# EAGLE design Arduino_PID_for_Espresso_v2_Rev_C (EAGLE 6.4)
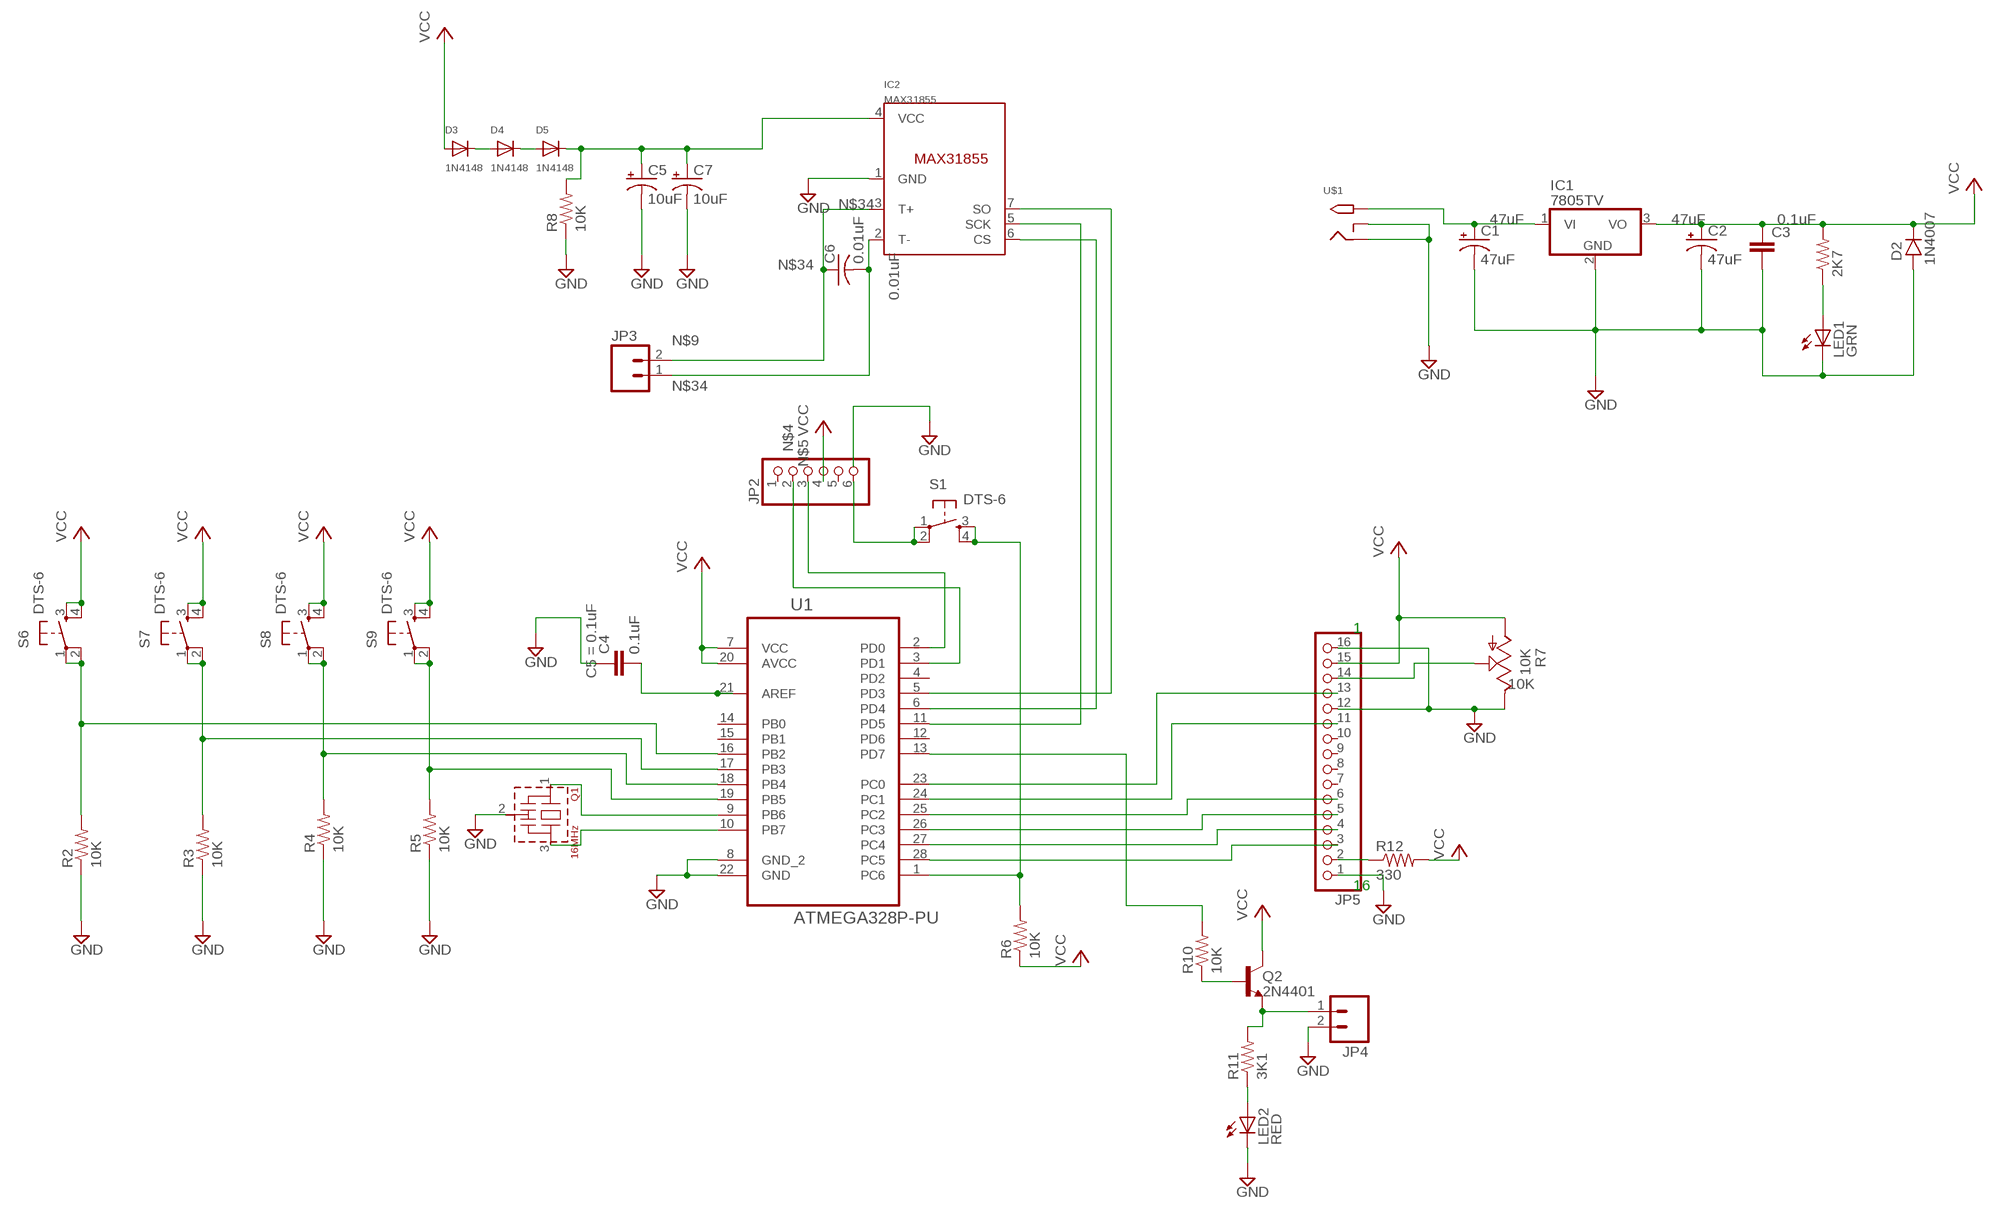
[diagram p0: schematic, sheet 1]

## Parts
C1  47uF  CPOL-USTT6D6  [TT5D6]
C2  47uF  CPOL-USTT6D6  [TT5D6]
C3  C-EU025-024X044  [C025-024X044]
C4  0.1uF  C-EU025-024X044  [C025-024X044]
C5  10uF  CAP_POLPTH2  [CPOL-RADIAL-10UF-25V]
C6  0.01uF  C-US025-024X044  [C025-024X044]
C7  10uF  CAP_POLPTH2  [CPOL-RADIAL-10UF-25V]
D2  1N4007  1N400X.3  [DO41-3]
D3  1N4148  DIODEDO-1N4148  [DO-1N4148]
D4  1N4148  DIODEDO-1N4148  [DO-1N4148]
D5  1N4148  DIODEDO-1N4148  [DO-1N4148]
IC1  7805TV  [TO220V]
IC2  MAX31855  [SOIC8]
JP2  PINHD-1X6/90  [1X06/90]
JP3  M023.5MM  [SCREWTERMINAL-3.5MM-2]
JP4  M023.5MM  [SCREWTERMINAL-3.5MM-2]
JP5  PINHD-1X16  [1X16]
LED1  GRN  LED3MM  [LED3MM]
LED2  RED  LED3MM  [LED3MM]
Q1  16MHz  CSTLA_X  [CSTLA_T]
Q2  2N4401  2N3904  [TO92-]
R1  2K7  RESISTORPTH-1/4W  [AXIAL-0.4]
R2  10K  RESISTORPTH-1/6W  [1/6W-RES]
R3  10K  RESISTORPTH-1/6W  [1/6W-RES]
R4  10K  RESISTORPTH-1/6W  [1/6W-RES]
R5  10K  RESISTORPTH-1/6W  [1/6W-RES]
R6  10K  RESISTORPTH-1/6W  [1/6W-RES]
R7  10K  TRIM_US-B25P  [B25P]
R8  10K  RESISTORPTH-1/6W  [1/6W-RES]
R10  10K  RESISTORPTH-1/6W  [1/6W-RES]
R11  3K1  RESISTORPTH-1/4W  [AXIAL-0.4]
R12  330  RESISTORPTH-1/4W  [AXIAL-0.4]
S1  DTS-6  [DTS-6]
S6  DTS-6  [DTS-6]
S7  DTS-6  [DTS-6]
S8  DTS-6  [DTS-6]
S9  DTS-6  [DTS-6]
U1  ATMEGA328P-PU  [DIP254P762X457-28]
U$1  2.1MMJACKTHM  [PJ-102A]

## Nets
GND: C1.- C2.- C3.2 C4.1 C5.2(-) C7.2(-) D2.A IC1.2(GND) IC2.1(GND) JP2.6 JP4.2 JP5.1 JP5.12 JP5.16 LED1.K(C) LED2.K(C) Q1.2(VSS) R2.1 R3.1 R4.1 R5.1 R7.E R8.1 S1.1 S1.2 U1.8(GND_2) U1.22(GND) U$1.RING U$1.RING_SW
N$1: C1.+ IC1.1(VI) U$1.TIP
N$2: C4.2 U1.21(AREF)
N$3: LED1.A R1.P$1
N$4: JP2.2 U1.3(PD1)
N$5: JP2.3 U1.2(PD0)
N$6: R2.2 S6.1 S6.2 U1.16(PB2)
N$7: JP5.14 R7.S
N$8: JP5.2 R12.P$1
N$9: C6.2 IC2.2(T-) JP3.1
N$10: R4.2 S8.1 S8.2 U1.18(PB4)
N$11: Q1.1 U1.9(PB6)
N$12: Q1.3 U1.10(PB7)
N$14: R6.2 S1.3 S1.4 U1.1(PC6)
N$15: R3.2 S7.1 S7.2 U1.17(PB3)
N$16: R5.2 S9.1 S9.2 U1.19(PB5)
N$18: JP5.3 U1.28(PC5)
N$19: JP5.4 U1.27(PC4)
N$20: IC2.6(CS) U1.6(PD4)
N$21: JP5.5 U1.26(PC3)
N$22: IC2.7(SO) U1.5(PD3)
N$23: IC2.5(SCK) U1.11(PD5)
N$24: D3.C D4.A
N$25: D4.C D5.A
N$26: C5.1(+) C7.1(+) D5.C IC2.4(VCC) R8.2
N$27: JP5.6 U1.25(PC2)
N$28: JP5.11 U1.24(PC1)
N$29: JP5.13 U1.23(PC0)
N$30: Q2.2(B) R10.1
N$31: JP4.1 Q2.3(E) R11.P$2
N$32: R10.2 U1.13(PD7)
N$33: LED2.A R11.P$1
N$34: C6.1 IC2.3(T+) JP3.2
VCC: C2.+ C3.1 D2.C D3.A IC1.3(VO) JP2.4 JP5.15 Q2.1(C) R1.P$2 R6.1 R7.A R12.P$2 S6.3 S6.4 S7.3 S7.4 S8.3 S8.4 S9.3 S9.4 U1.7(VCC) U1.20(AVCC)
Unconnected: JP2.1 JP2.5 JP5.7 JP5.8 JP5.9 JP5.10 U1.4(PD2) U1.12(PD6) U1.14(PB0) U1.15(PB1)

## Notes on the sheet
- 1
- 16

## Library data of the parts
C1 = rcl:CPOL-US: POLARIZED CAPACITOR, American symbol; C1: 47uF
C2 = rcl:CPOL-US: POLARIZED CAPACITOR, American symbol; C2: 47uF
C3 = rcl:C-EU: CAPACITOR, European symbol; C3: 0.1uF
C4 = rcl:C-EU: CAPACITOR, European symbol; C5: 0.1uF
C5 C7 = SparkFun-Passives:CAP_POL: Capacitor Polarized These are standard SMD and PTH capacitors. Normally 10uF, 47uF, and 100uF in electrolytic and tantalum varieties. Always verify the external diameter of the through hole cap, it varies with capacity, voltage, and manufacturer. The EIA devices should be standard.
C6 = adafruit:C-US: CAPACITOR, American symbol; C6: 0.01uF
D2 = gm-diodes:1N400X: Rectifier Diodes often used in power supply to prevent damage from reverse polarization
D3-D5 = adafruit:DIODE: Diode SMADIODE - SMA Surface Mount Package 20V 1A Schottky Diode Digikey: 641-1014-6-ND DO-1N4148 - Through Hole Small Current Diode SOD-123 20V 1 A (.5mV Vf) Schottky Diode - Digikey: MBRX120TPMSCT-ND SOD-323 10V 570mA (.38mV Vf, 3ns) Schottky Diode - Digikey: ZLLS410CT-ND SOD-523 30V 30mA Schottky Diode (RB751S-40TE61) - Digikey: RB751S-40TE61CT-ND SOT23-R/W - SOT23 Package (R = Solder Paste/Reflow Ovens, W = Hand-Soldering) BAT54Film 40V 300mA - Digikey: 497-7162-1-ND
IC1 = linear:78*: Positive VOLTAGE REGULATOR Source: http://cache.national.com/ds/LM/LM78L05.pdf http://www.fairchildsemi.com/ds/LM/LM7805.pdf
IC2 = AlexW-Eagle-Libraries:MAX31855
JP2 = 1x6pinhead:PINHD-1X6: PIN HEADER
JP3 JP4 = SparkFun-Connectors:M02: Header 2 Standard 2-pin 0.1" header. Use with straight break away headers (SKU : PRT-00116), right angle break away headers (PRT-00553), swiss pins (PRT-00743), machine pins (PRT-00117), and female headers (PRT-00115). Molex polarized connector foot print use with SKU : PRT-08233 with associated crimp pins and housings.
JP5 = pinhead:PINHD-1X16: PIN HEADER
LED1 LED2 = adafruit:LED: LED OSRAM: - CHIPLED LG R971, LG N971, LY N971, LG Q971, LY Q971, LO R971, LY R971 LH N974, LH R974 LS Q976, LO Q976, LY Q976 LO Q996 - Hyper CHIPLED LW Q18S LB Q993, LB Q99A, LB R99A - SideLED LS A670, LO A670, LY A670, LG A670, LP A670 LB A673, LV A673, LT A673, LW A673 LH A674 LY A675 LS A676, LA A676, LO A676, LY A676, LW A676 LS A679, LY A679, LG A679 - Hyper Micro SIDELED® LS Y876, LA Y876, LO Y876, LY Y876 LT Y87S - SmartLED LW L88C, LW L88S LB L89C, LB L89S, LG L890 LS L89K, LO L89K, LY L89K LS L896, LA L896, LO L896, LY L896 - TOPLED LS T670, LO T670, LY T670, LG T670, LP T670 LSG T670, LSP T670, LSY T670, LOP T670, LYG T670 LG T671, LOG T671, LSG T671 LB T673, LV T673, LT T673, LW T673 LH T674 LS T676, LA T676, LO T676, LY T676, LB T676, LH T676, LSB T676, LW T676 LB T67C, LV T67C, LT T67C, LS T67K, LO T67K, LY T67K, LW E67C LS E67B, LA E67B, LO E67B, LY E67B, LB E67C, LV E67C, LT E67C LW T67C LS T679, LY T679, LG T679 LS T770, LO T770, LY T770, LG T770, LP T770 LB T773, LV T773, LT T773, LW T773 LH T774 LS E675, LA E675, LY E675, LS T675 LS T776, LA T776, LO T776, LY T776, LB T776 LHGB T686 LT T68C, LB T68C - Hyper Mini TOPLED® LB M676 - Mini TOPLED Santana® LG M470 LS M47K, LO M47K, LY M47K Source: http://www.osram.convergy.de/
Q1 = murata-resonators:CSTLA_X: Ceramic resonator 13.01 to 15.99 MHz
Q2 = gm-trans:2N3904: NPN Transistor
R1-R6 R8 R10 R12 = SparkFun-Passives:RESISTOR: Resistor Basic schematic elements and footprints for 0603, 1206, and PTH resistors.
R7 = pot:TRIM_US-: POTENTIOMETER; VR1: 10K
R11 = SparkFun-Resistors:RESISTOR: Resistor Basic schematic elements and footprints for 0603, 1206, and PTH resistors.
S1 S6-S9 = switch-tact:DTS-6
U1 = Atmel_By_element14_Batch_1:ATMEGA328P-PU: 8-bit Microcontroller with In-System Programmable Flash; MPN: ATMEGA328P-PU; OC_FARNELL: 1715487; OC_NEWARK: 15R0268; PACKAGE: PDIP-28; SUPPLIER: Atmel
U$1 = adafruit:2.1MMJACK: 2.1mm x 5.5mm THM DC jack with internal switch. Digikey part #PJ-102A, 4UCON part #05537 2.1mm x 5.5mm SMT DC jack with internal switch. Digikey part #PJ-002A-SMT, 4UCON part #03267 By microbuilder.eu & adafruit.com

## Board
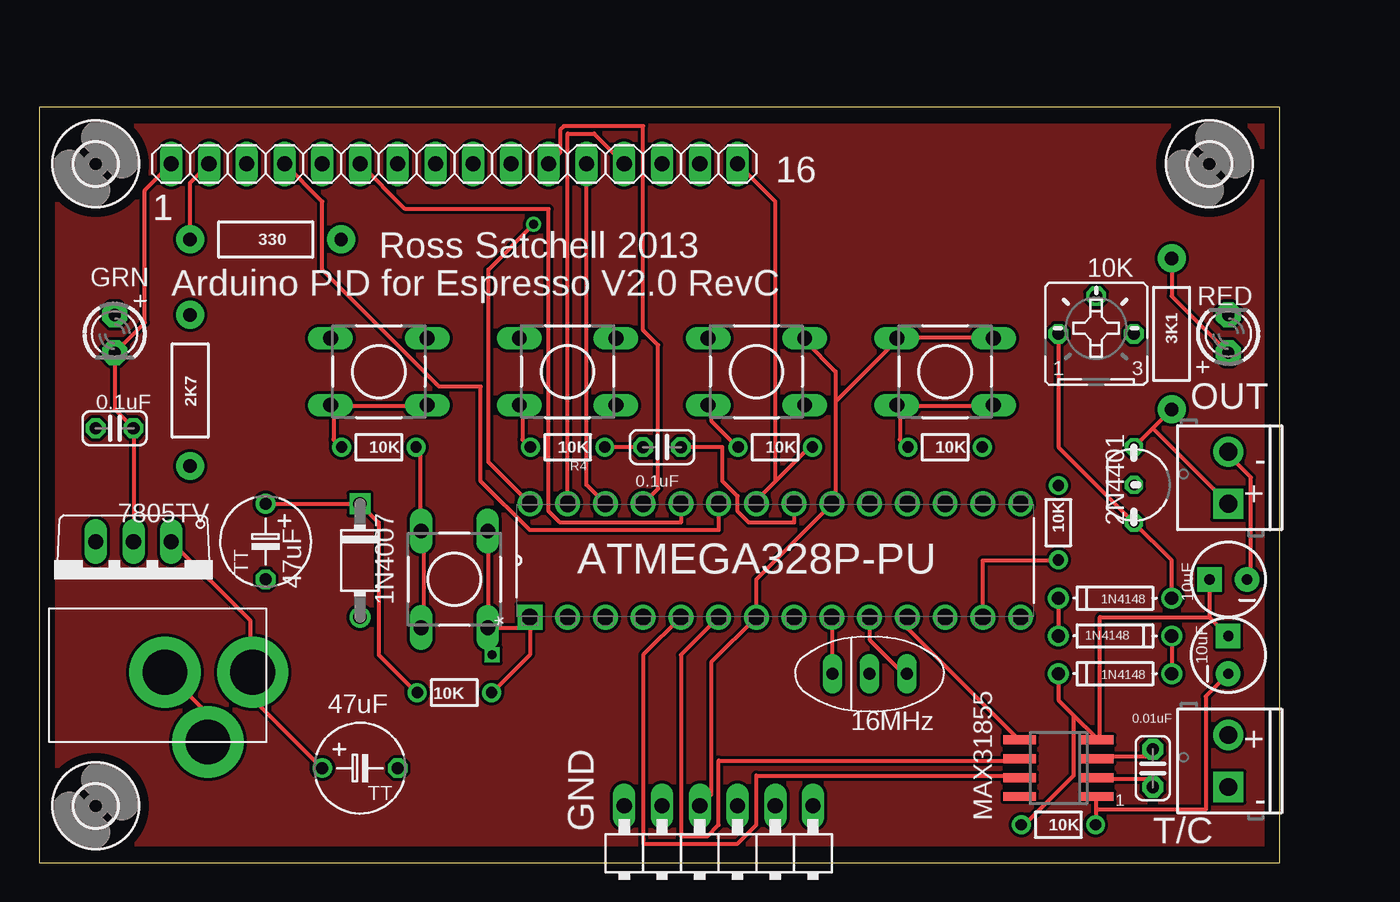
[diagram p1: board, top side]
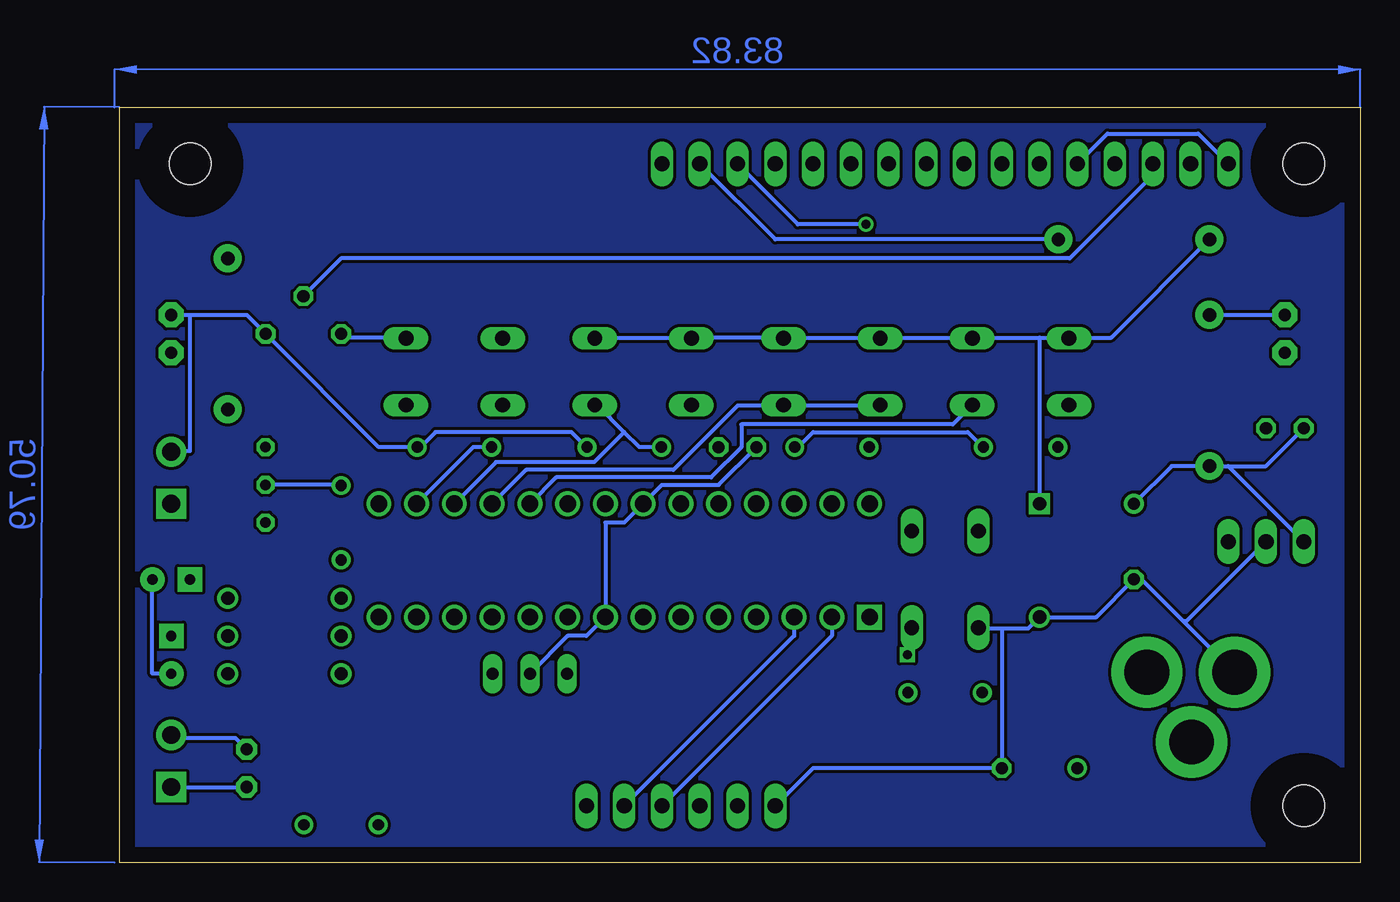
[diagram p2: board, bottom side, seen from below]

Size 83.49 x 50.79 mm. Coordinates in mm from the lower left corner, seen from the top.
Outline: 0,0 83.49,0 83.49,50.79 0,50.79 0,0
Copper layers (1*16): Top 0.035mm / dielectric 1.5mm / Bottom 0.035mm
Design rules "default": minimum track width 10mil, minimum drill 24mil, track to track 8mil, track to pad 8mil, pad to pad 8mil, via to via 8mil, smd to smd 8mil, copper to edge 40mil, drill to drill 8mil, minimum pad ring 10mil, minimum via ring 8mil, stop-mask expansion 4mil, vias tented up to drill 0mil, thermal gap 10mil

### Footprints (pad centres in the part's own frame; a part is rotated, then mirrored left to right if it is on the bottom)
TT5D6 = drill 0.813: + -2.54,0 | drill 0.813 octagon: - 2.54,0
C025-024X044 = drill 0.813 octagon: 1 -1.27,0; 2 1.27,0
CPOL-RADIAL-10UF-25V = drill 0.7 pad 1.651 square: 1 1.27,0 | drill 0.7 pad 1.651: 2 -1.27,0
C025-024X044' = drill 0.813 pad 1.422 octagon: 1 -1.27,0; 2 1.27,0
DO41-3 = drill 0.9: A 3.81,0 | drill 0.9 square: C -3.81,0
DO-1N4148 = drill 0.9: A -3.81,0; C 3.81,0
TO220V = drill 1.016 long: 1 -2.54,-2.54; 2 0,-2.54; 3 2.54,-2.54
SOIC8 = smd 0.6 x 2.2: 1 -1.905,-2.6; 2 -0.635,-2.6; 3 0.635,-2.6; 4 1.905,-2.6; 5 1.905,2.6; 6 0.635,2.6; 7 -0.635,2.6; 8 -1.905,2.6
1X06/90 = drill 1.016 long: 1 -6.35,-3.81; 2 -3.81,-3.81; 3 -1.27,-3.81; 4 1.27,-3.81; 5 3.81,-3.81; 6 6.35,-3.81
SCREWTERMINAL-3.5MM-2 = drill 1.2 pad 2.032 square: 1 0,0 | drill 1.2 pad 2.032: 2 3.5,0
1X16 = drill 1.016 long: 1 -19.05,0; 2 -16.51,0; 3 -13.97,0; 4 -11.43,0; 5 -8.89,0; 6 -6.35,0; 7 -3.81,0; 8 -1.27,0; 9 1.27,0; 10 3.81,0; 11 6.35,0; 12 8.89,0; 13 11.43,0; 14 13.97,0; 15 16.51,0; 16 19.05,0
LED3MM = drill 0.813 pad 1.676 octagon: A -1.27,0; K 1.27,0
CSTLA_T = drill 0.813 long: 1 -2.5,0; 2 0,0; 3 2.5,0
TO92- = drill 0.7 octagon: 1 2.54,0; 2 0,0; 3 -2.54,0
AXIAL-0.4 = drill 0.9 pad 1.88: P$1 -5.08,0; P$2 5.08,0
1/6W-RES = drill 0.762: 1 -2.5,0; 2 2.5,0
B25P = drill 0.813 octagon: A -2.54,0; E 2.54,0; S 0,2.54
DTS-6 = drill 1 long: 1 -3.25,2.25; 2 3.25,2.25; 3 -3.25,-2.25; 4 3.25,-2.25
DIP254P762X457-28 = drill 1.118 square: 1 -7.62,33.02 | drill 1.118: 2 -7.62,30.48; 3 -7.62,27.94; 4 -7.62,25.4; 5 -7.62,22.86; 6 -7.62,20.32; 7 -7.62,17.78; 8 -7.62,15.24; 9 -7.62,12.7; 10 -7.62,10.16; 11 -7.62,7.62; 12 -7.62,5.08; 13 -7.62,2.54; 14 -7.62,0; 15 0,0; 16 0,2.54; 17 0,5.08; 18 0,7.62; 19 0,10.16; 20 0,12.7; 21 0,15.24; 22 0,17.78; 23 0,20.32; 24 0,22.86; 25 0,25.4; 26 0,27.94; 27 0,30.48; 28 0,33.02
PJ-102A = drill 3 pad 4.8: RING 0.1,-3.39; RING_SW -4.6,-6.29; TIP 0.1,-9.29
2,8 = hole 2.8: 0,0

### Placement (x,y rotation side)
C1  21.59,6.35 0 top
C2  15.24,21.59 270 top
C3  5.08,29.21 0 top
C4  41.91,27.94 0 top
C5  80.01,19.05 180 top
C6  0.01uF  [C025-024X044']  74.93,6.35 270 top
C7  80.01,13.97 90 top
D2  21.59,20.32 270 top
D3  72.39,17.78 180 top
D4  72.39,15.24 0 top
D5  72.39,12.7 180 top
IC1  6.35,19.05 180 top
IC2  68.58,6.35 90 top
JP2  45.72,0 180 top
JP3  80.01,5.08 90 top
JP4  80.01,24.13 90 top
JP5  27.94,46.99 180 top
LED1  5.08,35.56 270 top
LED2  80.01,35.56 90 top
Q1  55.88,12.7 0 top
Q2  73.66,25.4 270 top
R1  10.16,31.75 270 top
R2  60.96,27.94 180 top
R3  49.53,27.94 180 top
R4  35.56,27.94 180 top
R5  22.86,27.94 180 top
R6  27.94,11.43 0 top
R7  71.12,35.56 0 top
R8  68.58,2.54 180 top
R10  68.58,22.86 270 top
R11  76.2,35.56 270 top
R12  15.24,41.91 180 top
S1  27.94,19.05 90 top
S6  60.96,33.02 180 top
S7  48.26,33.02 180 top
S8  35.56,33.02 180 top
S9  22.86,33.02 180 top
U1  66.04,24.13 90 top
U$1  5.08,12.7 90 top
U$2  [2,8]  78.74,46.99 0 top
U$3  [2,8]  3.81,3.81 0 top
U$4  [2,8]  3.81,46.99 0 top

### Tracks (layer width: path | path; a pad name or v marks a point on that pad's centre or on a via)
GND
  Top 0.254: IC1.2 C3.2 5.08,30.48 LED1.K 7.11,36.32 7.11,45.21 JP5.16 | U$1.RING 8.64,12.7 11.18,10.16 11.18,8.13 U$1.RING_SW | R5.1 25.4,27.94 25.65,27.69 25.65,22.35 S1.2 25.91,22.1 25.91,16 S1.1 | 71.12,3.56 71.12,2.54 R8.1 | 71.12,3.56 71.12,4.32 IC2.1 | 71.12,3.56 78.49,3.56 78.49,11.18 C7.2 | C5.2 81.53,19.3 81.53,25.91 80.01,27.43 JP4.2 | C4.1 R4.1 | 49.53,25.65 48.26,24.38 U1.22 | 49.53,25.65 51.82,27.94 R3.1 | JP5.1 49.53,44.45 49.53,25.65
  Bottom 0.254: JP5.16 10.92,49.02 17.02,49.02 JP5.12 | 24.13,15.75 C1.- 36.83,6.35 JP2.6 | 24.13,15.75 25.65,15.75 S1.1 | 24.13,15.75 22.35,15.75 D2.A 17.78,16.51 C2.- 14.73,19.05 11.94,16.26 | 11.94,16.26 8.64,12.95 U$1.RING | IC1.2 11.68,16.26 11.94,16.26 | LED2.K 78.74,36.83 | 78.74,36.83 74.93,36.83 R7.E 66.04,27.94 R2.1 63.25,27.94 62.23,28.96 53.09,28.96 52.07,27.94 R3.1 | C5.2 81.28,12.7 C7.2 | 78.74,36.83 78.74,27.69 80.01,27.69 JP4.2 | Q1.2 53.34,15.24 52.07,15.24 U1.8 50.8,22.86 49.53,22.86 U1.22 46.99,25.4 43.18,25.4 C4.1 | R5.1 25.4,27.94 26.42,28.96 36.83,28.96 37.85,27.94 R4.1
N$1
  Top 0.254: C1.+ 14.48,10.92 14.48,12.7 U$1.TIP 14.22,12.95 14.22,16.26 IC1.1
N$2
  Top 0.254: C4.2 45.97,27.94 45.97,25.65 46.99,24.64 46.99,23.62 47.75,22.86 50.8,22.86 U1.21
N$3
  Bottom 0.254: R1.P$1 LED1.A
N$4
  Bottom 0.254: JP2.2 38.1,15.24 U1.3
N$5
  Bottom 0.254: JP2.3 35.56,15.24 U1.2
N$6
  Top 0.254: 57.91,30.73 57.91,28.45 58.42,27.94 R2.2 | 57.91,30.73 64.01,30.73 S6.1 | 57.91,30.73 S6.2
  Bottom 0.254: U1.16 59.69,27.94 R2.2
N$7
  Bottom 0.254: R7.S 68.58,40.64 19.56,40.64 13.97,46.23 JP5.14
N$8
  Bottom 0.254: JP5.2 39.37,41.91 R12.P$1
N$9
  Top 0.254: C6.2 74.93,5.59 71.37,5.59 IC2.2
  Bottom 0.254: JP3.1 C6.2
N$10
  Top 0.254: R4.2 33.02,27.94 32.51,28.45 32.51,30.73 S8.2
  Bottom 0.254: S8.2 32.51,30.73 38.61,30.73 S8.1 38.86,30.73 41.91,30.73 46.23,26.42 56.13,26.42 U1.18
N$11
  Top 0.254: U1.9 53.34,12.7 Q1.1
N$12
  Top 0.254: U1.10 55.88,14.99 58.17,12.7 Q1.3
N$13  (via drill 0.6)
  other vias: 30.48,13.97
N$14
  Top 0.254: 33.02,15.75 33.02,13.97 30.48,11.43 R6.2 | 33.02,15.75 30.23,15.75 S1.3 30.23,16 30.23,22.1 S1.4 | 33.02,15.75 U1.1
N$15
  Top 0.254: R3.2 46.99,27.94 45.21,29.72 45.21,30.73 S7.2
  Bottom 0.254: 49.53,28.96 48.51,27.94 R3.2 | 49.53,28.96 51.31,30.73 S7.1 | U1.17 58.17,26.92 51.56,26.92 49.53,28.96
N$16
  Top 0.254: 19.81,30.73 19.81,28.45 20.32,27.94 R5.2 | 19.81,30.73 25.91,30.73 S9.1 | 19.81,30.73 S9.2
  Bottom 0.254: U1.19 54.1,25.91 43.69,25.91 41.66,27.94 41.66,29.46 27.43,29.46 26.16,30.73 S9.1
N$17
  pour Top: 1.27,49.53 82.55,49.53 82.55,1.27 1.27,1.27
N$18  (via drill 0.61)
  Top 0.254: v33.27,42.93 30.23,39.88 30.23,26.92 U1.28
  Bottom 0.254: JP5.3 37.85,42.93 v33.27,42.93
N$19
  Top 0.254: JP5.4 37.34,49.02 35.56,49.02 U1.27
N$20
  Top 0.254: U1.6 43.18,13.97 43.18,1.78 44.96,1.78 45.72,2.54 45.72,6.86 65.79,6.86 IC2.6
N$21
  Top 0.254: JP5.5 36.83,25.4 U1.26
N$22
  Top 0.254: U1.5 40.64,13.97 40.64,1.27 46.99,1.27 48.26,2.54 48.26,5.84 65.79,5.84 IC2.7
N$23
  Top 0.254: U1.11 58.42,15.75 65.79,8.38 IC2.5
N$24
  Top 0.254: D3.C D4.A
N$25
  Top 0.254: D4.C D5.A
N$26
  Top 0.254: 78.74,16.51 C7.1 | C5.1 78.74,16.51 | 69.6,9.91 68.58,10.92 D5.C | 69.6,9.91 71.12,8.38 IC2.4 71.37,8.38 71.37,16.51 78.74,16.51 | 69.6,9.91 69.6,5.84 66.29,2.54 R8.2
N$27
  Top 0.254: JP5.6 35.05,47.75 35.05,49.28 35.31,49.53 40.64,49.53 40.64,35.81 41.66,34.8 41.66,25.15 U1.25
N$28
  Top 0.254: JP5.11 24.64,43.94 34.29,43.94 34.29,23.62 35.05,22.86 43.18,22.86 U1.24
N$29
  Top 0.254: JP5.13 19.05,44.45 19.05,39.88 26.92,32 29.72,32 29.72,25.65 33.02,22.35 45.72,22.35 U1.23
N$30
  Bottom 0.254: Q2.2 68.58,25.4 R10.1
N$31
  Top 0.254: R11.P$2 74.93,29.21 | 74.93,29.21 Q2.3 | 74.93,29.21 JP4.1
N$32
  Top 0.254: U1.13 63.5,20.32 68.58,20.32 R10.2
N$33
  Top 0.254: LED2.A 76.2,38.1 R11.P$1
N$34
  Top 0.254: C6.1 74.93,7.11 71.37,7.11 IC2.3
  Bottom 0.254: C6.1 75.69,8.38 80.01,8.38 JP3.2
N$35
  pour Bottom: 1.27,49.53 82.55,49.53 82.55,1.27 1.27,1.27
VCC
  Top 0.254: R6.1 25.4,11.43 22.86,13.97 22.86,22.86 D2.C C2.+ | D3.A 76.2,20.32 Q2.1 68.58,27.94 R7.A | S6.3 64.01,35.31 57.91,35.31 S6.4 57.66,35.05 53.59,30.99 | JP2.4 45.21,4.57 45.21,13.46 U1.7 48.26,19.05 U1.20 53.59,24.38 53.59,30.99 | JP5.15 10.16,45.72 R12.P$2 | 53.59,30.99 53.59,33.02 51.56,35.05 S7.3
  Bottom 0.254: C2.+ 12.7,26.67 R1.P$2 8.89,26.67 | C3.1 6.35,26.67 8.89,26.67 | 8.89,26.67 IC1.3 | R7.A 68.33,35.31 64.26,35.31 S6.3 | S7.3 51.31,35.31 45.21,35.31 S7.4 44.96,35.31 38.86,35.31 S8.3 38.61,35.31 32.51,35.31 S8.4 32.26,35.31 26.16,35.31 S9.3 25.91,35.31 21.59,35.31 | 21.59,35.31 19.81,35.31 S9.4 19.56,35.31 16.76,35.31 R12.P$2 | 21.59,35.31 D2.C
(copper drawn outside any net)
  shapes: Bottom area x2

### Text on the board
tPlace: 16 | 1 | Ross Satchell 2013 | Arduino PID for Espresso V2.0 RevC | 0.1uF | OUT | - | + | GND | + | - | 1 | T/C